# Altium schematic sheet USB.SchDoc
size A4
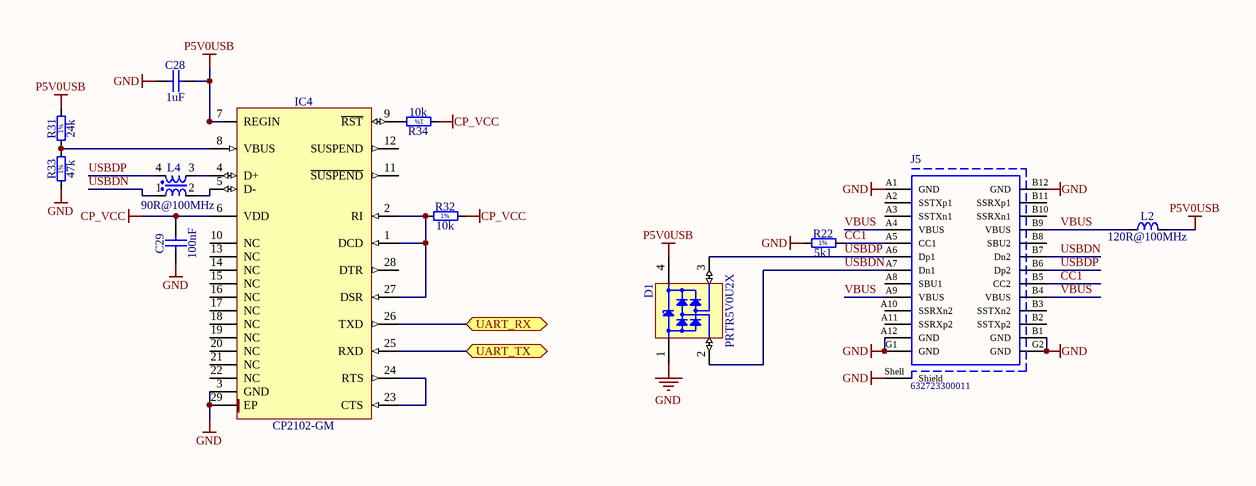
[diagram p0: USB.SchDoc]

## Parts
C28  1uF  [CAPC1005X55N]
C29  100nF  [CAPC1005X55N]
D1  PRTR5V0U2X  [SOT190P230X110-4N]
IC4  CP2102-GM  [QFN50P500X500X100-29N-S335]
J5  632723300011  [632723300011]
L2  120R@100MHz  [INDC1608X65N]
L4  90R@100MHz  [IND_MURATA_DLW21S]
R22  5k1  [RESC1005X40N]
R31  24k  [RESC1005X40N]
R32  10k  [RESC1005X40N]
R33  47k  [RESC1005X40N]
R34  10k  [RESC1005X40N]

## Ports
UART_RX (bidir), UART_TX (bidir)

## Nets
CP_VCC: C29.2 IC4.6(VDD) R32.2 R34.1
GND: C28.1 C29.1 D1.1(GND) IC4.3(GND) IC4.29(EP) J5.A1(GND) J5.A12(GND) J5.B1(GND) J5.B12(GND) J5.G1(GND) J5.G2(GND) J5.Shell(Shield) R22.1 R33.1
P5V0USB: C28.2 D1.4(VCC) IC4.7(REGIN) L2.2 R31.2
CC1: J5.A5(CC1) J5.B5(CC2) R22.2
UART_RX: IC4.26(TXD) ; port UART_RX
UART_TX: IC4.25(RXD) ; port UART_TX
USBDN: D1.2(I/O1) J5.A7(Dn1) J5.B7(Dn2) L4.1
USBDP: D1.3(I/O2) J5.A6(Dp1) J5.B6(Dp2) L4.4
VBUS: J5.A4(VBUS) J5.A9(VBUS) J5.B4(VBUS) J5.B9(VBUS) L2.1
NetIC4_1: IC4.1(DCD) IC4.2(RI) IC4.27(DSR) R32.1
NetIC4_4: IC4.4(D+) L4.3
NetIC4_5: IC4.5(D-) L4.2
NetIC4_8: IC4.8(VBUS) R31.1 R33.2
NetIC4_9: IC4.9(~{RST}) R34.2
NetIC4_23: IC4.23(CTS) IC4.24(RTS)

Not connected (* = marked no-connect by the designer): IC4 10(NC) 11(~{SUSPEND}) 12(SUSPEND) 13(NC) 14(NC) 15(NC) 16(NC) 17(NC) 18(NC) 19(NC) 20(NC) 21(NC) 22(NC) 28(DTR); J5 A2(SSTXp1) A3(SSTXn1) A8(SBU1) A10(SSRXn2) A11(SSRXp2) B2(SSTXp2) B3(SSTXn2) B8(SBU2) B10(SSRXn1) B11(SSRXp1)

## Notes on the sheet
- (in symbol R0402_5K1_1%_0.0625W_100PPM) 1%
- (in symbol R0402_10K_1%_0.0625W_100PPM) 1%
- (in symbol R0402_24K_1%_0.0625W_100PPM) 1%
- (in symbol R0402_47K_1%_0.0625W_100PPM) 1%

## Library data of the parts
C28 = CC0402_1UF_16V_10%_X5R: Non-polarised capacitor; Part Description: SMD Multilayer Chip Ceramic Capacitor; Manufacturer: GENERIC; Manufacturer1 Part Number: C1005X5R1C105KT; Voltage: 16V; TC: X5R; Tolerance: ±10%; Part Number: CC0402_1UF_16V_10%_X5R; Component Kind: Standard; Component Type: Standard; Pin Count: 2; Value: 1uF; Status: Preferred; Manufacturer Part Number: CC0402_1UF_16V_10%_X5R; Case: 0402; Mounted: Yes; Socket: No; SMD: Yes; Sense: No; Manufacturer1 Example: TDK; Manufacturer1 ComponentHeight: 0.55mm; HelpURL: \\cern.ch\dfs\Applications\Altium\Datasheets\CC0402_X5R_TDK_C.pdf; Author: CERN DEM JLC; CreateDate: 2012-10-25; LatestRevisionDate: 2012-10-25
C29 = CC0402_100NF_16V_10%_X5R: Non-polarised capacitor; Part Description: SMD Multilayer Chip Ceramic Capacitor; Manufacturer: GENERIC; Manufacturer1 Part Number: GRM155R61C104KA88D; Voltage: 16V; TC: X5R; Tolerance: ±10%; Part Number: CC0402_100NF_16V_10%_X5R; Component Kind: Standard; Component Type: Standard; Pin Count: 2; Value: 100nF; Status: None; Manufacturer Part Number: CC0402_100NF_16V_10%_X5R; Case: 0402; Mounted: Yes; Socket: No; SMD: Yes; Sense: No; Manufacturer1 Example: MURATA; Manufacturer1 ComponentHeight: 0.55mm; HelpURL: \\cern.ch\dfs\Applications\Altium\Datasheets\CC0402_X5R_MURATA_GRM.pdf; Author: CERN DEM JLC; CreateDate: 2013-12-10; LatestRevisionDate: 2013-12-10
D1 = PRTR5V0U2X: Ultra Low Capacitance Double Rail-to-Rail ESD Protection Diode; Part Description: Ultra Low Capacitance (1pF) Double Rail-to-Rail ESD Protection Diode (8kV); Manufacturer: NXP SEMICONDUCTORS; Voltage: 5.5V; PressFit: No; Bonding: No; Part Number: PRTR5V0U2X; Component Kind: Standard; Component Type: Standard; Device: PRTR5V0U2X; PackageDescription: SOT143B, SOT, 1.90mm Pitch; 4 Pin, 1.30mm W X 2.90mm L X 1.10mm H body, IPC Medium Density; Manufacturer Part Number: PRTR5V0U2X; Pin Count: 4; Case: SOT143B; Mounted: Yes; Socket: No; SMD: Yes; Sense: No; ComponentHeight: 1.1mm; HelpURL: \\cern.ch\dfs\Applications\Altium\Datasheets\PRTR5V0U2X.pdf; Author: CERN DEM JLC; CreateDate: 2011-03-22; LatestRevisionDate: 2011-03-22
IC4 = CP2102-GM: Single-Chip USB to UART Bridge; Manufacturer: SILICON LABS; PressFit: No; Bonding: No; Part Number: CP2102-GM; Component Kind: Standard; Component Type: Standard; Device: CP2102-GM; PackageDescription: QFN, 0.50mm Pitch, Square; 28 pin, 5.00mm L X 5.00mm W X 1.00mm H body (w/thermal tab 3.35 X 3.35mm),  IPC Medium Density; Part Description: Single-Chip USB to UART Bridge; Manufacturer Part Number: CP2102-GM; Pin Count: 29; Case: QFN28; Mounted: Yes; Socket: No; SMD: Yes; Sense: No; ComponentHeight: 1.0mm; Author: CERN DEM JLC; HelpURL: \\cern.ch\dfs\Applications\Altium\Datasheets\CP2102-GM.pdf; CreateDate: 03.03.2011; LatestRevisionDate: 03.03.2011
J5 = 632723300011: USB 3.1 Type C Receptacle WR-COM, Horizontal, SMT / THT; Rated Current: 5 A; Contact Resistance: 30 mOhm; Working Voltage: 20 VDC; ComponentLink1Description: Manufacturer; ComponentLink1URL: http://www.we-online.de; ComponentLink2Description: Datasheet; ComponentLink2URL: https://katalog.we-online.de/em/datasheet/632723x00011%282%29.pdf; Part Number: 632723300011; Published Date: September 2018; Publisher: Wurth Elektronik; Orientation: Horizontal; Connector Type: USB 3.1 Type C; Operating Temperature: -40 to 105 degC; Mounting Technology: SMT / THT; Gender: Receptacle; Packaging: Tape and Reel
L2 = IND0603_MURATA_BLM18SG121TN1D: Inductor; Part Description: SMD EMIFIL Suppression Chip Ferrite Bead; Manufacturer: MURATA; Power: 3A; Resistance: 0.025R; Tolerance: ±25%; Table: Inductors SMD; Part Number: IND0603_MURATA_BLM18SG121TN1D; Component Kind: Standard; Component Type: Standard; Pin Count: 2; Value: 120R@100MHz; Status: None; Manufacturer Part Number: BLM18SG121TN1D; Case: 0603; Mounted: Yes; Socket: No; SMD: Yes; ComponentHeight: 0.65mm; HelpURL: \\cern.ch\dfs\Applications\Altium\Datasheets\IND0603_MURATA_BLM18S.pdf; Author: CERN DEM JLC; CreateDate: 2014-07-23; LatestRevisionDate: 2014-07-23
L4 = IND_MURATA_DLW21SN900SQ2L: Inductor Common Mode; Part Description: Wire Wound Common Mode Choke Coil (DLW21S Series); Manufacturer: MURATA; Power: 330mA; Resistance: 0.35R; Tolerance: ±25%; Part Number: IND_MURATA_DLW21SN900SQ2L; Component Kind: Standard; Component Type: Standard; Pin Count: 4; Value: 90R@100MHz; Status: None; Manufacturer Part Number: DLW21SN900SQ2L; Case: 0805; Mounted: Yes; Socket: No; SMD: Yes; Sense: No; ComponentHeight: 1.4mm; HelpURL: \\cern.ch\dfs\Applications\Altium\Datasheets\IND_MURATA_DLW21S.pdf; Author: CERN DEM JLC; CreateDate: 01.07.2014; LatestRevisionDate: 01.07.2014
R22 = R0402_5K1_1%_0.0625W_100PPM: Resistor - 1%; Part Description: General Purpose Thick Film Chip Resistor; Manufacturer: GENERIC; Manufacturer1 Part Number: 232270675102L; TC: ±100ppm/°C; PressFit: No; Part Number: R0402_5K1_1%_0.0625W_100PPM; Component Kind: Standard; Component Type: Standard; Pin Count: 2; Value: 5k1; Status: Not Recommended; Power: 0.0625W; Tolerance: ±1%; Manufacturer Part Number: R0402_5K1_1%_0.0625W_100PPM; Case: 0402; Mounted: Yes; Sense: No; Socket: No; SMD: Yes; Manufacturer1 Example: YAGEO PHYCOMP; Manufacturer1 ComponentHeight: 0.4mm; HelpURL: \\cern.ch\dfs\Applications\Altium\Datasheets\R0402_Phycomp_RC0402.pdf; Author: CERN DEM JLC; CreateDate: 03.12.2007; LatestRevisionDate: 17.10.2012
R31 = R0402_24K_1%_0.0625W_100PPM: Resistor - 1%; Part Description: General Purpose Thick Film Chip Resistor; Manufacturer: GENERIC; Manufacturer1 Part Number: 232270672403L; TC: ±100ppm/°C; Part Number: R0402_24K_1%_0.0625W_100PPM; Component Kind: Standard; Component Type: Standard; Pin Count: 2; Value: 24k; Status: Not recommended; Power: 0.0625W; Tolerance: ±1%; Manufacturer Part Number: R0402_24K_1%_0.0625W_100PPM; Case: 0402; Mounted: Yes; Sense: No; Socket: No; SMD: Yes; Manufacturer1 Example: YAGEO PHYCOMP; Manufacturer1 ComponentHeight: 0.4mm; HelpURL: \\cern.ch\dfs\Applications\Altium\Datasheets\R0402_Phycomp_RC0402.pdf; Author: CERN DEM JLC; CreateDate: 2007-12-03; LatestRevisionDate: 2012-10-17
R32 R34 = R0402_10K_1%_0.0625W_100PPM: Resistor - 1%; Part Description: General Purpose Thick Film Chip Resistor; Manufacturer: GENERIC; Manufacturer1 Part Number: 232270671003L; TC: ±100ppm/°C; Part Number: R0402_10K_1%_0.0625W_100PPM; Component Kind: Standard; Component Type: Standard; Pin Count: 2; Value: 10k; Status: Not recommended; Power: 0.0625W; Tolerance: ±1%; Manufacturer Part Number: R0402_10K_1%_0.0625W_100PPM; Case: 0402; Mounted: Yes; Sense: No; Socket: No; SMD: Yes; Manufacturer1 Example: YAGEO PHYCOMP; Manufacturer1 ComponentHeight: 0.4mm; HelpURL: \\cern.ch\dfs\Applications\Altium\Datasheets\R0402_Phycomp_RC0402.pdf; Author: CERN DEM JLC; CreateDate: 2007-12-03; LatestRevisionDate: 2012-10-17
R33 = R0402_47K_1%_0.0625W_100PPM: Resistor - 1%; Part Description: General Purpose Thick Film Chip Resistor; Manufacturer: GENERIC; Manufacturer1 Part Number: 232270675103L; TC: ±100ppm/°C; Part Number: R0402_47K_1%_0.0625W_100PPM; Component Kind: Standard; Component Type: Standard; Pin Count: 2; Value: 47k; Status: Not recommended; Power: 0.0625W; Tolerance: ±1%; Manufacturer Part Number: R0402_47K_1%_0.0625W_100PPM; Case: 0402; Mounted: Yes; Sense: No; Socket: No; SMD: Yes; Manufacturer1 Example: YAGEO PHYCOMP; Manufacturer1 ComponentHeight: 0.4mm; HelpURL: \\cern.ch\dfs\Applications\Altium\Datasheets\R0402_Phycomp_RC0402.pdf; Author: CERN DEM JLC; CreateDate: 2007-12-03; LatestRevisionDate: 2012-10-17